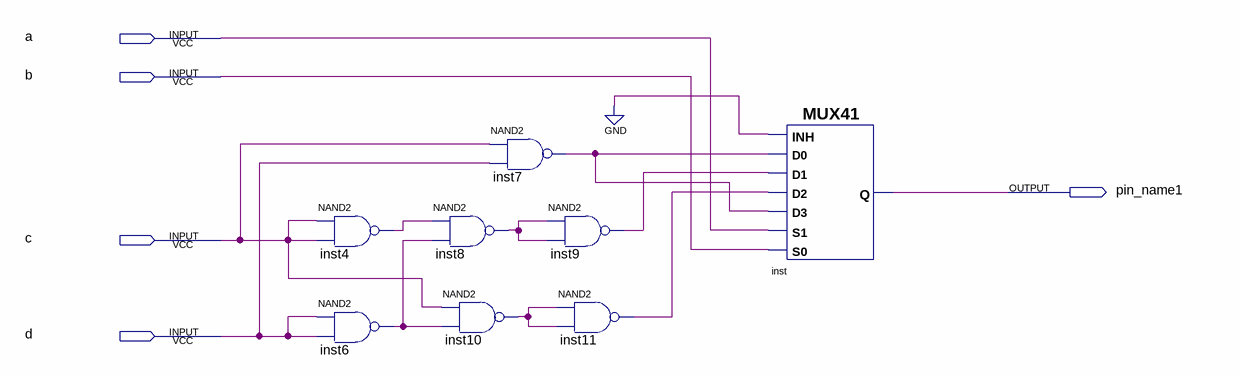
[diagram p0: schematic sheet]
// Quartus schematic Lab3.bdf as structural Verilog: 8 symbols, 5 pins
module Lab3 (
  input  a,
  input  b,
  input  c,
  input  d,
  output pin_name1
);

  wire inst4_out, inst6_out, inst7_out, inst8_out, inst9_out, inst10_out, inst11_out;

  nand inst4 (inst4_out, c, c);
  nand inst6 (inst6_out, d, d);
  nand inst8 (inst8_out, inst4_out, inst6_out);
  nand inst10 (inst10_out, c, inst6_out);
  nand inst7 (inst7_out, c, d);
  nand inst9 (inst9_out, inst8_out, inst8_out);
  nand inst11 (inst11_out, inst10_out, inst10_out);
  MUX41 inst (
    .S0(b), .D2(inst11_out), .S1(a), .D3(inst7_out), .D0(inst7_out), .INH(1'b0), .D1(inst9_out), .Q(pin_name1));
endmodule
